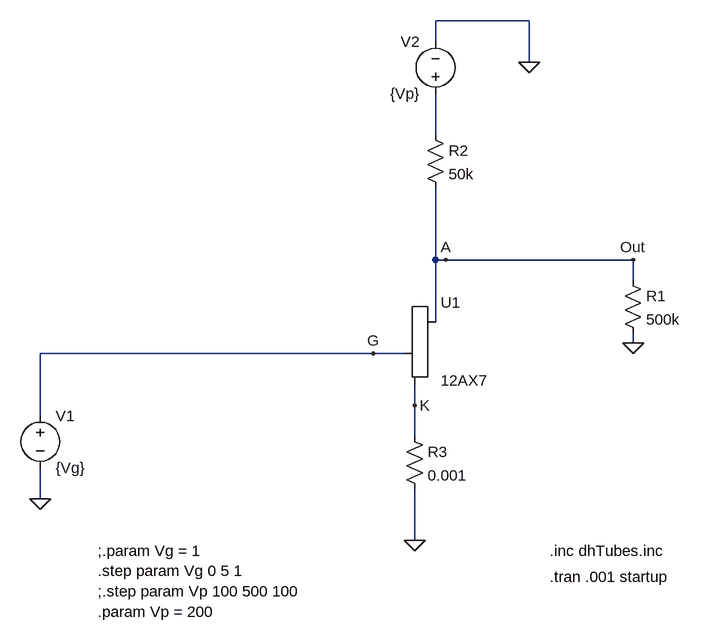
[diagram p0: schematic Triode2.asc]
Triode2.asc, the LTspice schematic file:
Version 4
SHEET 1 880 680
WIRE 384 -336 240 -336
WIRE 240 -304 240 -336
WIRE 384 -272 384 -336
WIRE 240 -160 240 -224
WIRE 240 32 240 -80
WIRE 256 32 240 32
WIRE 544 32 256 32
WIRE 544 64 544 32
WIRE 240 128 240 32
WIRE 544 160 544 144
WIRE 144 176 -368 176
WIRE 192 176 144 176
WIRE 208 256 208 224
WIRE -368 272 -368 176
WIRE 208 304 208 256
WIRE -368 400 -368 352
WIRE 208 464 208 384
FLAG 544 160 0
FLAG -368 400 0
FLAG 384 -272 0
FLAG 208 256 K
FLAG 144 176 G
FLAG 256 32 A
FLAG 544 32 Out
FLAG 208 464 0
SYMBOL Misc\\triode 240 176 R0
SYMATTR InstName U1
SYMATTR Value 12AX7
SYMATTR SpiceModel 12AX7
SYMBOL voltage -368 256 R0
WINDOW 123 0 0 Left 0
WINDOW 39 0 0 Left 0
SYMATTR InstName V1
SYMATTR Value {Vg}
SYMBOL voltage 240 -208 R180
WINDOW 0 24 96 Left 2
WINDOW 3 24 16 Left 2
WINDOW 123 0 0 Left 0
WINDOW 39 0 0 Left 0
SYMATTR InstName V2
SYMATTR Value {Vp}
SYMBOL res 528 48 R0
SYMATTR InstName R1
SYMATTR Value 500k
SYMBOL res 224 -176 R0
SYMATTR InstName R2
SYMATTR Value 50k
SYMBOL res 192 288 R0
SYMATTR InstName R3
SYMATTR Value 0.001
TEXT 416 480 Left 2 !.inc dhTubes.inc
TEXT 416 520 Left 2 !.tran .001 startup
TEXT -280 480 Left 2 !;.param Vg = 1\n.step param Vg 0 5 1\n;.step param Vp 100 500 100\n.param Vp = 200

The netlist it stands for:
* Triode2.asc
XU1 Out G K 12AX7 12AX7
V1 G 0 {Vg}
V2 N001 0 {Vp}
R1 Out 0 500k
R2 N001 Out 50k
R3 K 0 0.001
.inc dhTubes.inc
.tran .001 startup
;.param Vg = 1
.step param Vg 0 5 1
;.step param Vp 100 500 100
.param Vp = 200
.backanno
.end